# EAGLE schematic canbus module (EAGLE 9.1.0)
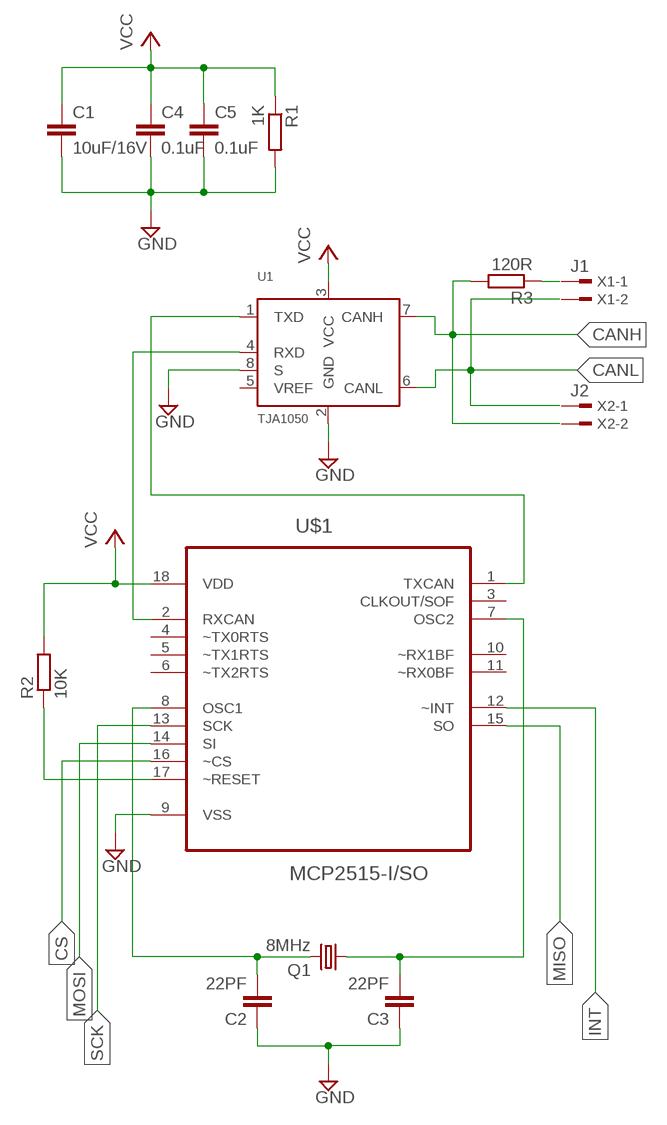
[diagram p0: schematic, sheet 1]

## Parts
C1  10uF/16V  C-EUC0805  [C0805]
C2  22PF  C-EUC0805  [C0805]
C3  22PF  C-EUC0805  [C0805]
C4  0.1uF  C-EUC0805  [C0805]
C5  0.1uF  C-EUC0805  [C0805]
Q1  8MHz  CRYSTALHC49S  [HC49/S]
R1  1K  R-EU_M0805  [M0805]
R2  10K  R-EU_M0805  [M0805]
R3  120R  R-EU_M0805  [M0805]
U1  TJA1050  [SOT96-1]
U$1  MCP2515-I/SO  [SOIC127P1034X264-18N]
X1  J1  TSW-102-07-G-S  [TSW-102-XX-G-S]
X2  J2  TSW-102-07-G-S  [TSW-102-XX-G-S]

## Nets
GND: C1.2 C2.1 C3.1 C4.2 C5.2 R1.2 U1.2(GND) U1.8(S) U$1.9(VSS)
N$1: R2.1 U$1.17(~RESET)
N$2: U1.1(TXD) U$1.1(TXCAN)
N$3: U1.4(RXD) U$1.2(RXCAN)
N$4: U$1.16(~CS)
N$5: U$1.12(~INT)
N$7: U$1.15(SO)
N$8: U$1.14(SI)
N$9: U$1.13(SCK)
N$10: U1.6(CANL)
N$11: C2.2 Q1.2 U$1.8(OSC1)
N$12: C3.2 Q1.1 U$1.7(OSC2)
N$14: R3.1
N$16: R3.2 U1.7(CANH)
VCC: C1.1 C4.1 C5.1 R1.1 R2.2 U1.3(VCC) U$1.18(VDD)
Unconnected: U1.5(VREF) U$1.3(CLKOUT/SOF) U$1.4(~TX0RTS) U$1.5(~TX1RTS) U$1.6(~TX2RTS) U$1.10(~RX1BF) U$1.11(~RX0BF) X1.1 X1.2 X2.1 X2.2

## Library data of the parts
C1-C5 = rcl:C-EU: CAPACITOR, European symbol; SPICEPREFIX: C
Q1 = crystal:CRYSTAL: CRYSTAL; OC_FARNELL: 1667008; OC_NEWARK: unknown
R1-R3 = rcl:R-EU_: RESISTOR, European symbol; SPICEPREFIX: R
U1 = TJA1050:TJA1050: High speed CAN transceiver The TJA1050 is the interface between the Controller Area Network (CAN) protocol controller and the physical bus. The device provides differential transmit capability to the bus and differential receive capability to the CAN controller. The TJA1050 is the third Philips high-speed CAN transceiver after the PCA82C250 and the PCA82C251. The most important differences are: Much lower electromagnetic emission due to optimal matching of the output signals CANH and CANL Improved behaviour in case of an unpowered node No standby mode. This makes the TJA1050 eminently suitable for use in nodes that are in a power-down situation in partially powered networks. AAL Eindhoven MK; AVAILABILITY: Unavailable; MF: NXP Semiconductors; MP: TJA1050; PACKAGE: None; PRICE: None
U$1 = MCP2515-I_SO:MCP2515-I/SO: CAN Controller; AVAILABILITY: Unavailable; DESCRIPTION: MCP2515 Series 5.5 V 1 Mb/s Stand Alone SPI Interface CAN Controller- SOIC-18; MF: Microchip; MP: MCP2515-I/SO; PACKAGE: SOIC-18 Microchip; PRICE: None
X1 X2 = con-samtec:TSW-102-*-G-S: THROUGH-HOLE .025" SQ POST HEADER Source: Samtec TSW.pdf; MF: Samtec Inc.; MPN: TSW-102-07-G-S